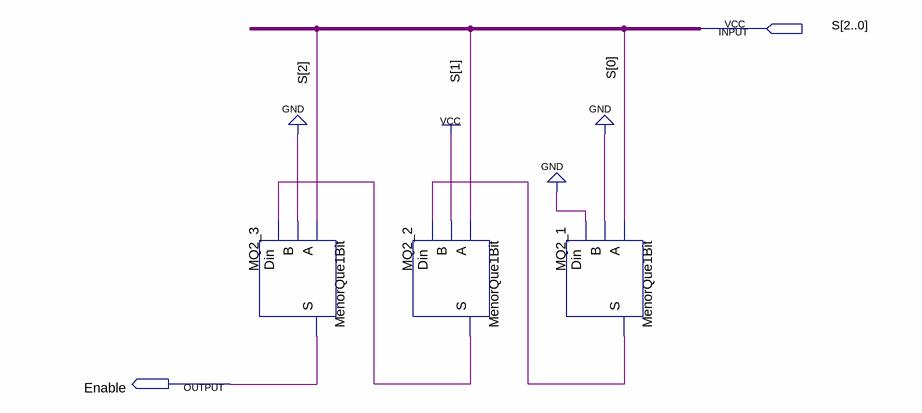
[diagram p0: schematic sheet]
// Quartus schematic MenorQue2.bdf as structural Verilog: 3 symbols, 2 pins
module MenorQue2 (
  input  [2:0] S,
  output Enable
);

  wire MQ2_1_s, MQ2_2_s;

  MenorQue1Bit MQ2_3 (.A(S[2]), .B(1'b0), .Din(MQ2_2_s), .S(Enable));
  MenorQue1Bit MQ2_2 (.A(S[1]), .B(1'b1), .Din(MQ2_1_s), .S(MQ2_2_s));
  MenorQue1Bit MQ2_1 (.A(S[0]), .B(1'b0), .Din(1'b0), .S(MQ2_1_s));
endmodule
